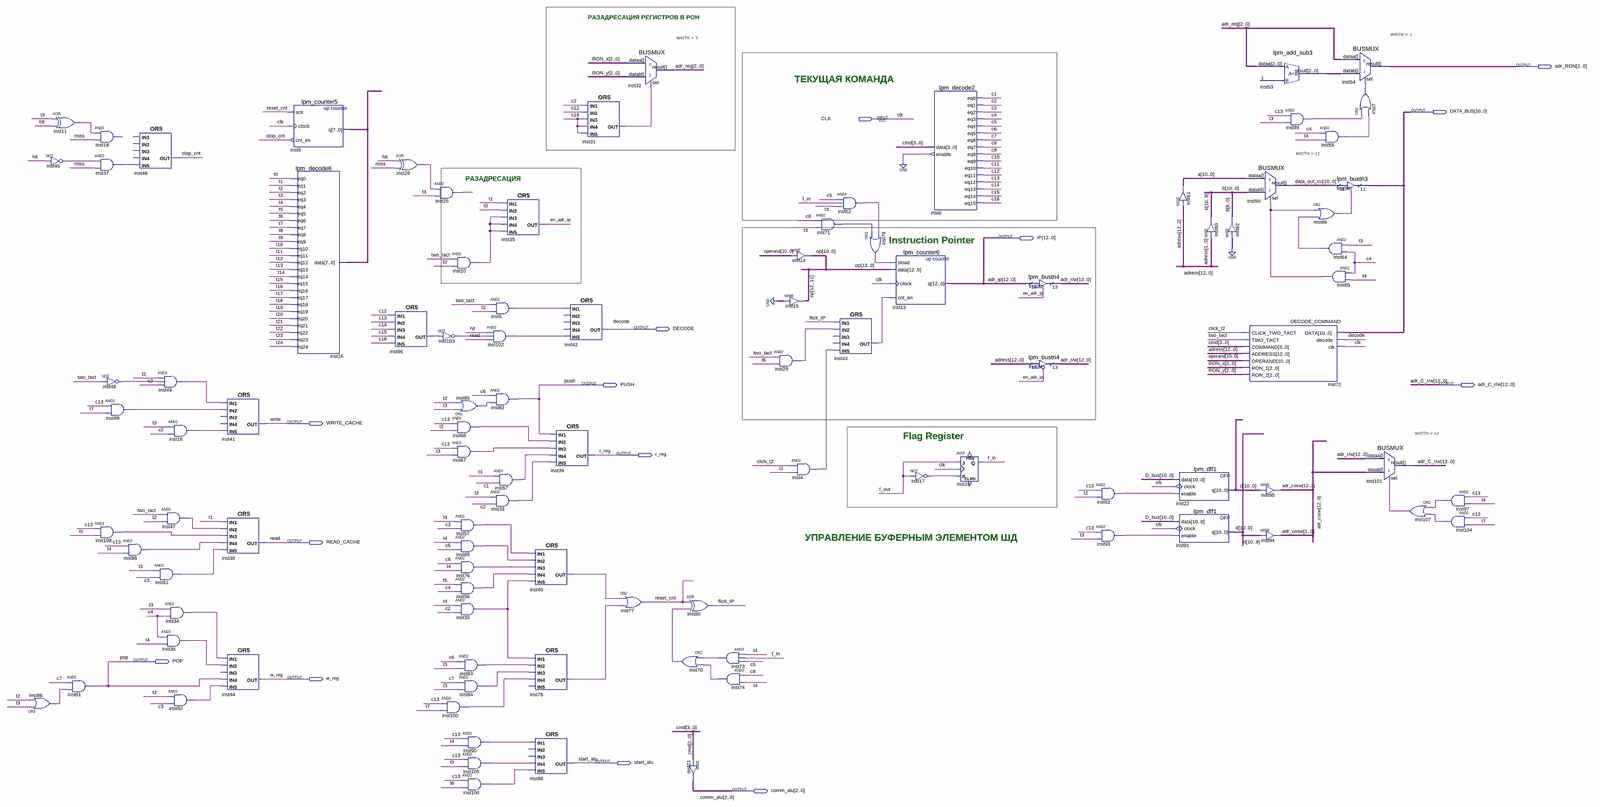
[diagram p0: schematic sheet, whole]
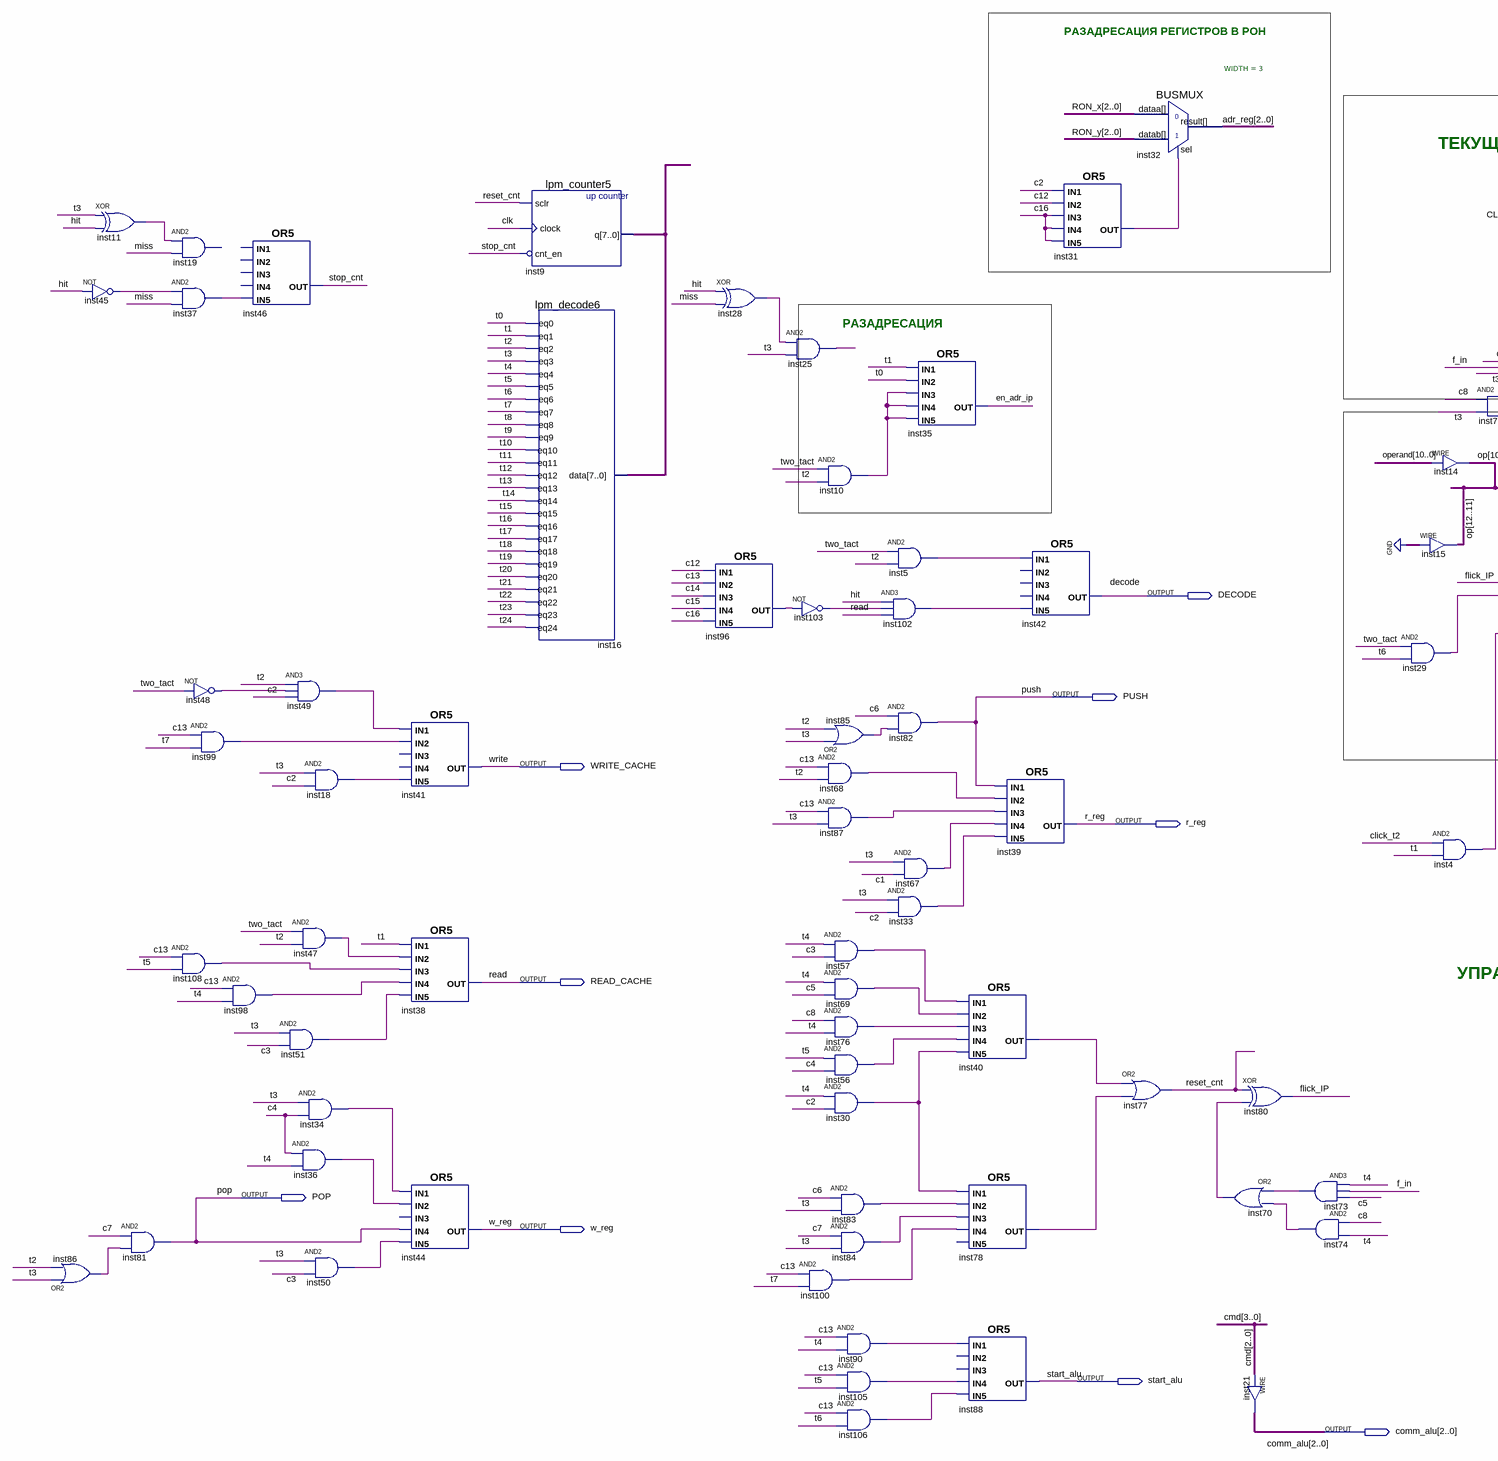
[diagram p1: schematic sheet, left part]
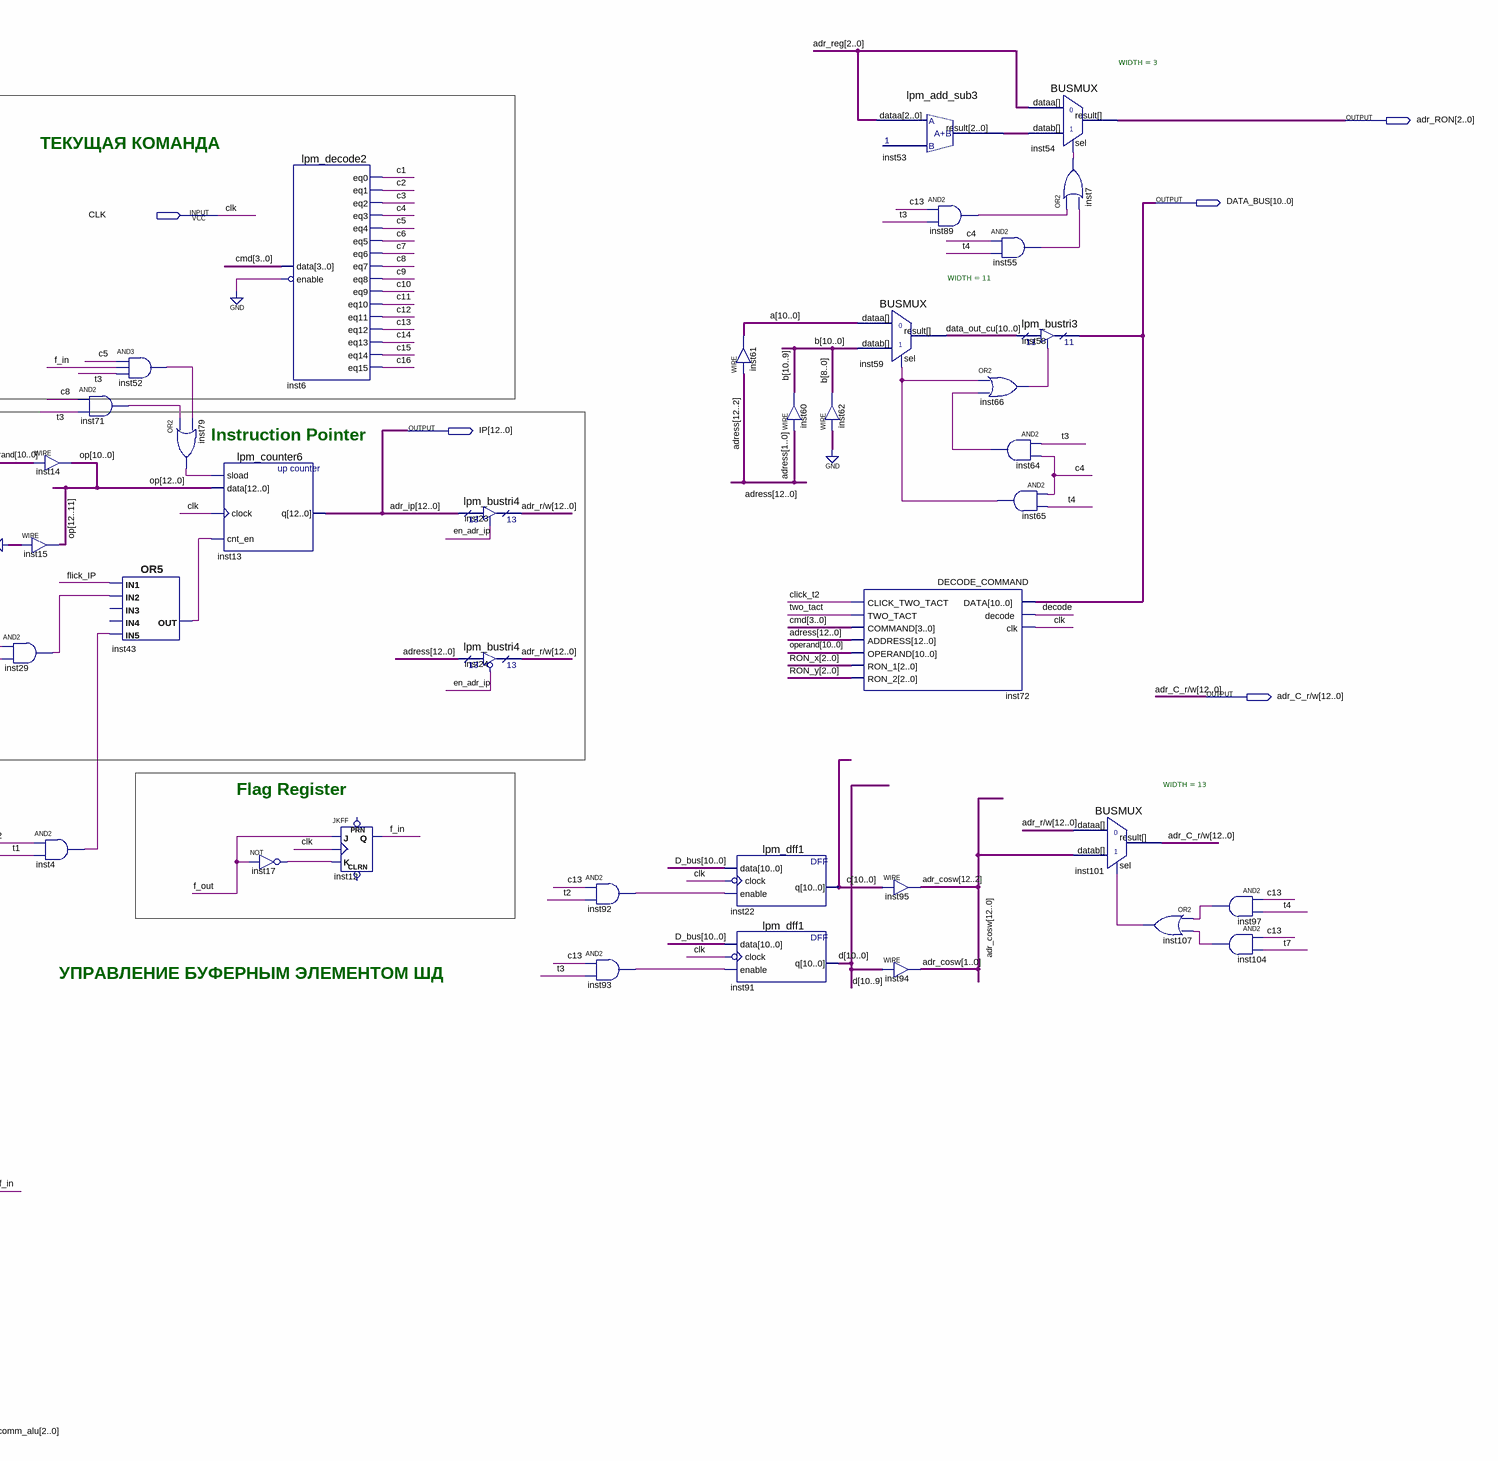
[diagram p2: schematic sheet, right part]
// Quartus schematic CU.bdf as structural Verilog: 99 symbols, 14 pins
module CU (
  input  CLK,
  output [2:0] adr_RON,
  output [10:0] DATA_BUS,
  output [12:0] IP,
  output DECODE,
  output PUSH,
  output [12:0] \adr_C_r/w ,
  output WRITE_CACHE,
  output r_reg,
  output READ_CACHE,
  output POP,
  output w_reg,
  output start_alu,
  output [2:0] comm_alu
);

  wire c11, c12, c13, c14, c15, c16, click_t2, en_adr_ip, f_in, f_out, flick_IP, hit, inst4_out, inst5_out,
       inst7_out, inst10_out, inst11_out, inst17_out, inst18_out, inst25_out, inst28_out, inst29_out,
       inst30_out, inst31_out, inst33_out, inst34_out, inst36_out, inst37_out, inst40_out, inst43_out,
       inst45_out, inst47_out, inst48_out, inst49_out, inst50_out, inst51_out, inst52_out, inst55_out,
       inst56_out, inst57_out, inst64_out, inst65_out, inst66_out, inst67_out, inst68_out, inst69_out,
       inst70_out, inst71_out, inst73_out, inst74_out, inst76_out, inst78_out, inst79_out, inst83_out,
       inst84_out, inst85_out, inst86_out, inst87_out, inst89_out, inst90_out, inst92_out, inst93_out,
       inst96_out, inst97_out, inst98_out, inst99_out, inst100_out, inst102_out, inst103_out, inst104_out,
       inst105_out, inst106_out, inst107_out, inst108_out, miss, reset_cnt, stop_cnt, t0, t1, t2, t3, t4, t5,
       t6, t7, t8, t9, t10, t11, t12, t13, t14, t15, t16, t17, t18, t19, t20, t21, t22, t23, t24, two_tact;
  wire [2:0] adr_reg, inst53_result, RON_x, RON_y;
  wire [3:0] cmd;
  wire [7:0] inst9_q;
  wire [10:0] a, b, c, d, D_bus, data_out_cu, operand;
  wire [12:0] adr_cosw, \adr_r/w , adress, op;

  or inst86 (inst86_out, t3, t2);
  xor inst11 (inst11_out, t3, hit);
  not inst45 (inst45_out, hit);
  and inst81 (POP, c[7], inst86_out);
  // AND2 inst19 has open pins: IN1=inst11_out, IN2=miss, OUT=open
  and inst37 (inst37_out, inst45_out, miss);
  not inst48 (inst48_out, two_tact);
  and inst99 (inst99_out, c13, t7);
  and inst108 (inst108_out, c13, t5);
  buf inst46 (stop_cnt, inst37_out);  // OR5 open: IN1, IN2, IN3, IN4
  and inst98 (inst98_out, c13, t4);
  and inst49 (inst49_out, t2, inst48_out, c[2]);
  and inst18 (inst18_out, t3, c[2]);
  and inst47 (inst47_out, two_tact, t2);
  and inst51 (inst51_out, t3, c[3]);
  and inst34 (inst34_out, t3, c[4]);
  and inst36 (inst36_out, c[4], t4);
  and inst50 (inst50_out, t3, c[3]);
  or inst41 (WRITE_CACHE, inst49_out, inst99_out, inst18_out);  // open: IN3, IN4
  or inst38 (READ_CACHE, t1, inst47_out, inst108_out, inst98_out, inst51_out);
  or inst44 (w_reg, inst34_out, inst36_out, POP, inst50_out);  // open: IN3
  lpm_counter5 inst9 (.sclr(reset_cnt), .clock(CLK), .cnt_en(~stop_cnt), .q(inst9_q));
  lpm_decode6 inst16 (
    .data(inst9_q), .eq0(t0), .eq1(t1), .eq2(t2), .eq3(t3), .eq4(t4), .eq5(t5), .eq6(t6), .eq7(t7), .eq8(t8),
    .eq9(t9), .eq10(t10), .eq11(t11), .eq12(t12), .eq13(t13), .eq14(t14), .eq15(t15), .eq16(t16), .eq17(t17),
    .eq18(t18), .eq19(t19), .eq20(t20), .eq21(t21), .eq22(t22), .eq23(t23), .eq24(t24));
  xor inst28 (inst28_out, hit, miss);
  or inst96 (inst96_out, c12, c13, c14, c15, c16);
  and inst25 (inst25_out, inst28_out, t3);
  and inst10 (inst10_out, two_tact, t2);
  not inst103 (inst103_out, inst96_out);
  or inst85 (inst85_out, t3, t2);
  and inst68 (inst68_out, c13, t2);
  and inst87 (inst87_out, c13, t3);
  and inst57 (inst57_out, t4, c[3]);
  and inst69 (inst69_out, t4, c[5]);
  and inst76 (inst76_out, c[8], t4);
  and inst56 (inst56_out, t5, c[4]);
  and inst30 (inst30_out, t4, c[2]);
  and inst100 (inst100_out, c13, t7);
  and inst83 (inst83_out, c[6], t3);
  and inst84 (inst84_out, c[7], t3);
  and inst90 (inst90_out, c13, t4);
  and inst105 (inst105_out, c13, t5);
  and inst106 (inst106_out, c13, t6);
  or inst35 (en_adr_ip, t1, t0, inst10_out, inst10_out, inst10_out);
  and inst5 (inst5_out, two_tact, t2);
  and inst102 (inst102_out, hit, inst103_out, READ_CACHE);
  and inst82 (PUSH, c[6], inst85_out);
  and inst67 (inst67_out, t3, c[1]);
  and inst33 (inst33_out, t3, c[2]);
  or inst40 (inst40_out, inst57_out, inst69_out, inst76_out, inst56_out, inst30_out);
  or inst78 (inst78_out, inst30_out, inst83_out, inst84_out, inst100_out);  // open: IN5
  or inst88 (start_alu, inst90_out, inst105_out, inst106_out);  // open: IN2, IN3
  or inst42 (DECODE, inst5_out, inst102_out);  // open: IN2, IN3, IN4
  or inst39 (r_reg, PUSH, inst68_out, inst87_out, inst67_out, inst33_out);
  or inst31 (inst31_out, c[2], c12, c16, c16, c16);
  or inst77 (reset_cnt, inst40_out, inst78_out);
  BUSMUX #(.WIDTH(3)) inst32 (.datab(RON_y), .sel(inst31_out), .dataa(RON_x), .result(adr_reg));
  or inst70 (inst70_out, inst73_out, inst74_out);
  xor inst80 (flick_IP, reset_cnt, inst70_out);
  assign comm_alu = cmd[2:0];  // WIRE inst21
  and inst73 (inst73_out, t4, f_in, c[5]);
  and inst74 (inst74_out, c[8], t4);
  assign op[10:0] = operand;  // WIRE inst14
  assign op[12:11] = 2'b00;  // WIRE inst15
  and inst29 (inst29_out, two_tact, t6);
  and inst4 (inst4_out, click_t2, t1);
  and inst71 (inst71_out, c[8], t3);
  and inst52 (inst52_out, c[5], f_in, t3);
  or inst43 (inst43_out, flick_IP, inst29_out, inst4_out);  // open: IN3, IN4
  or inst79 (inst79_out, inst71_out, inst52_out);
  lpm_counter6 inst13 (.sload(inst79_out), .data(op), .clock(CLK), .cnt_en(inst43_out), .q(IP));
  lpm_decode2 inst6 (
    .data(cmd), .enable(~1'b0), .eq0(c[1]), .eq1(c[2]), .eq2(c[3]), .eq3(c[4]), .eq4(c[5]), .eq5(c[6]),
    .eq6(c[7]), .eq7(c[8]), .eq8(c[9]), .eq9(c[10]), .eq10(c11), .eq11(c12), .eq12(c13), .eq13(c14),
    .eq14(c15), .eq15(c16));
  not inst17 (inst17_out, f_out);
  JKFF inst12 (.K(inst17_out), .J(f_out), .CLK(CLK), .Q(f_in));  // open: PRN, CLRN
  lpm_bustri4 inst23 (.enabledt(en_adr_ip), .data(IP), .tridata(\adr_r/w ));
  lpm_bustri4 inst24 (.enabledt(~en_adr_ip), .data(adress), .tridata(\adr_r/w ));
  and inst92 (inst92_out, c13, t2);
  and inst93 (inst93_out, c13, t3);
  assign a = adress[12:2];  // WIRE inst61
  lpm_dff1 inst22 (.data(D_bus), .clock(~CLK), .enable(inst92_out), .q(c));
  lpm_dff1 inst91 (.data(D_bus), .clock(~CLK), .enable(inst93_out), .q(d));
  assign b[10:9] = adress[1:0];  // WIRE inst60
  assign b[8:0] = {9{1'b0}};  // WIRE inst62
  lpm_add_sub3 inst53 (.dataa(adr_reg), .result(inst53_result));
  BUSMUX #(.WIDTH(11)) inst59 (.datab(b), .sel(inst65_out), .dataa(a), .result(data_out_cu));
  DECODE_COMMAND inst72 (
    .DATA(DATA_BUS), .decode(DECODE), .clk(CLK), .CLICK_TWO_TACT(click_t2), .TWO_TACT(two_tact),
    .COMMAND(cmd), .ADDRESS(adress), .OPERAND(operand), .RON_1(RON_x), .RON_2(RON_y));
  assign adr_cosw[12:2] = c;  // WIRE inst95
  assign adr_cosw[1:0] = d[10:9];  // WIRE inst94
  and inst89 (inst89_out, c13, t3);
  and inst55 (inst55_out, c[4], t4);
  or inst66 (inst66_out, inst65_out, inst64_out);
  and inst64 (inst64_out, t3, c[4]);
  and inst65 (inst65_out, c[4], t4);
  BUSMUX #(.WIDTH(3)) inst54 (.datab(inst53_result), .sel(inst7_out), .dataa(adr_reg), .result(adr_RON));
  lpm_bustri3 inst58 (.enabledt(inst66_out), .data(data_out_cu), .tridata(DATA_BUS));
  or inst7 (inst7_out, inst89_out, inst55_out);
  BUSMUX #(.WIDTH(13)) inst101 (.datab(adr_cosw), .sel(inst107_out), .dataa(\adr_r/w ), .result(\adr_C_r/w ));
  or inst107 (inst107_out, inst97_out, inst104_out);
  and inst97 (inst97_out, c13, t4);
  and inst104 (inst104_out, c13, t7);

  // Other names for the same wires on the sheet: adr_ip[12:0] = IP; read = READ_CACHE; write = WRITE_CACHE

  // Notes on the sheet:
  //   РАЗАДРЕСАЦИЯ РЕГИСТРОВ В РОН
  //   ТЕКУЩАЯ КОМАНДА
  //   РАЗАДРЕСАЦИЯ
  //   Instruction Pointer
  //   Flag Register
  //   УПРАВЛЕНИЕ БУФЕРНЫМ ЭЛЕМЕНТОМ ШД
endmodule
